# EAGLE schematic MONSTR_V0.1 (EAGLE 6.5.0)
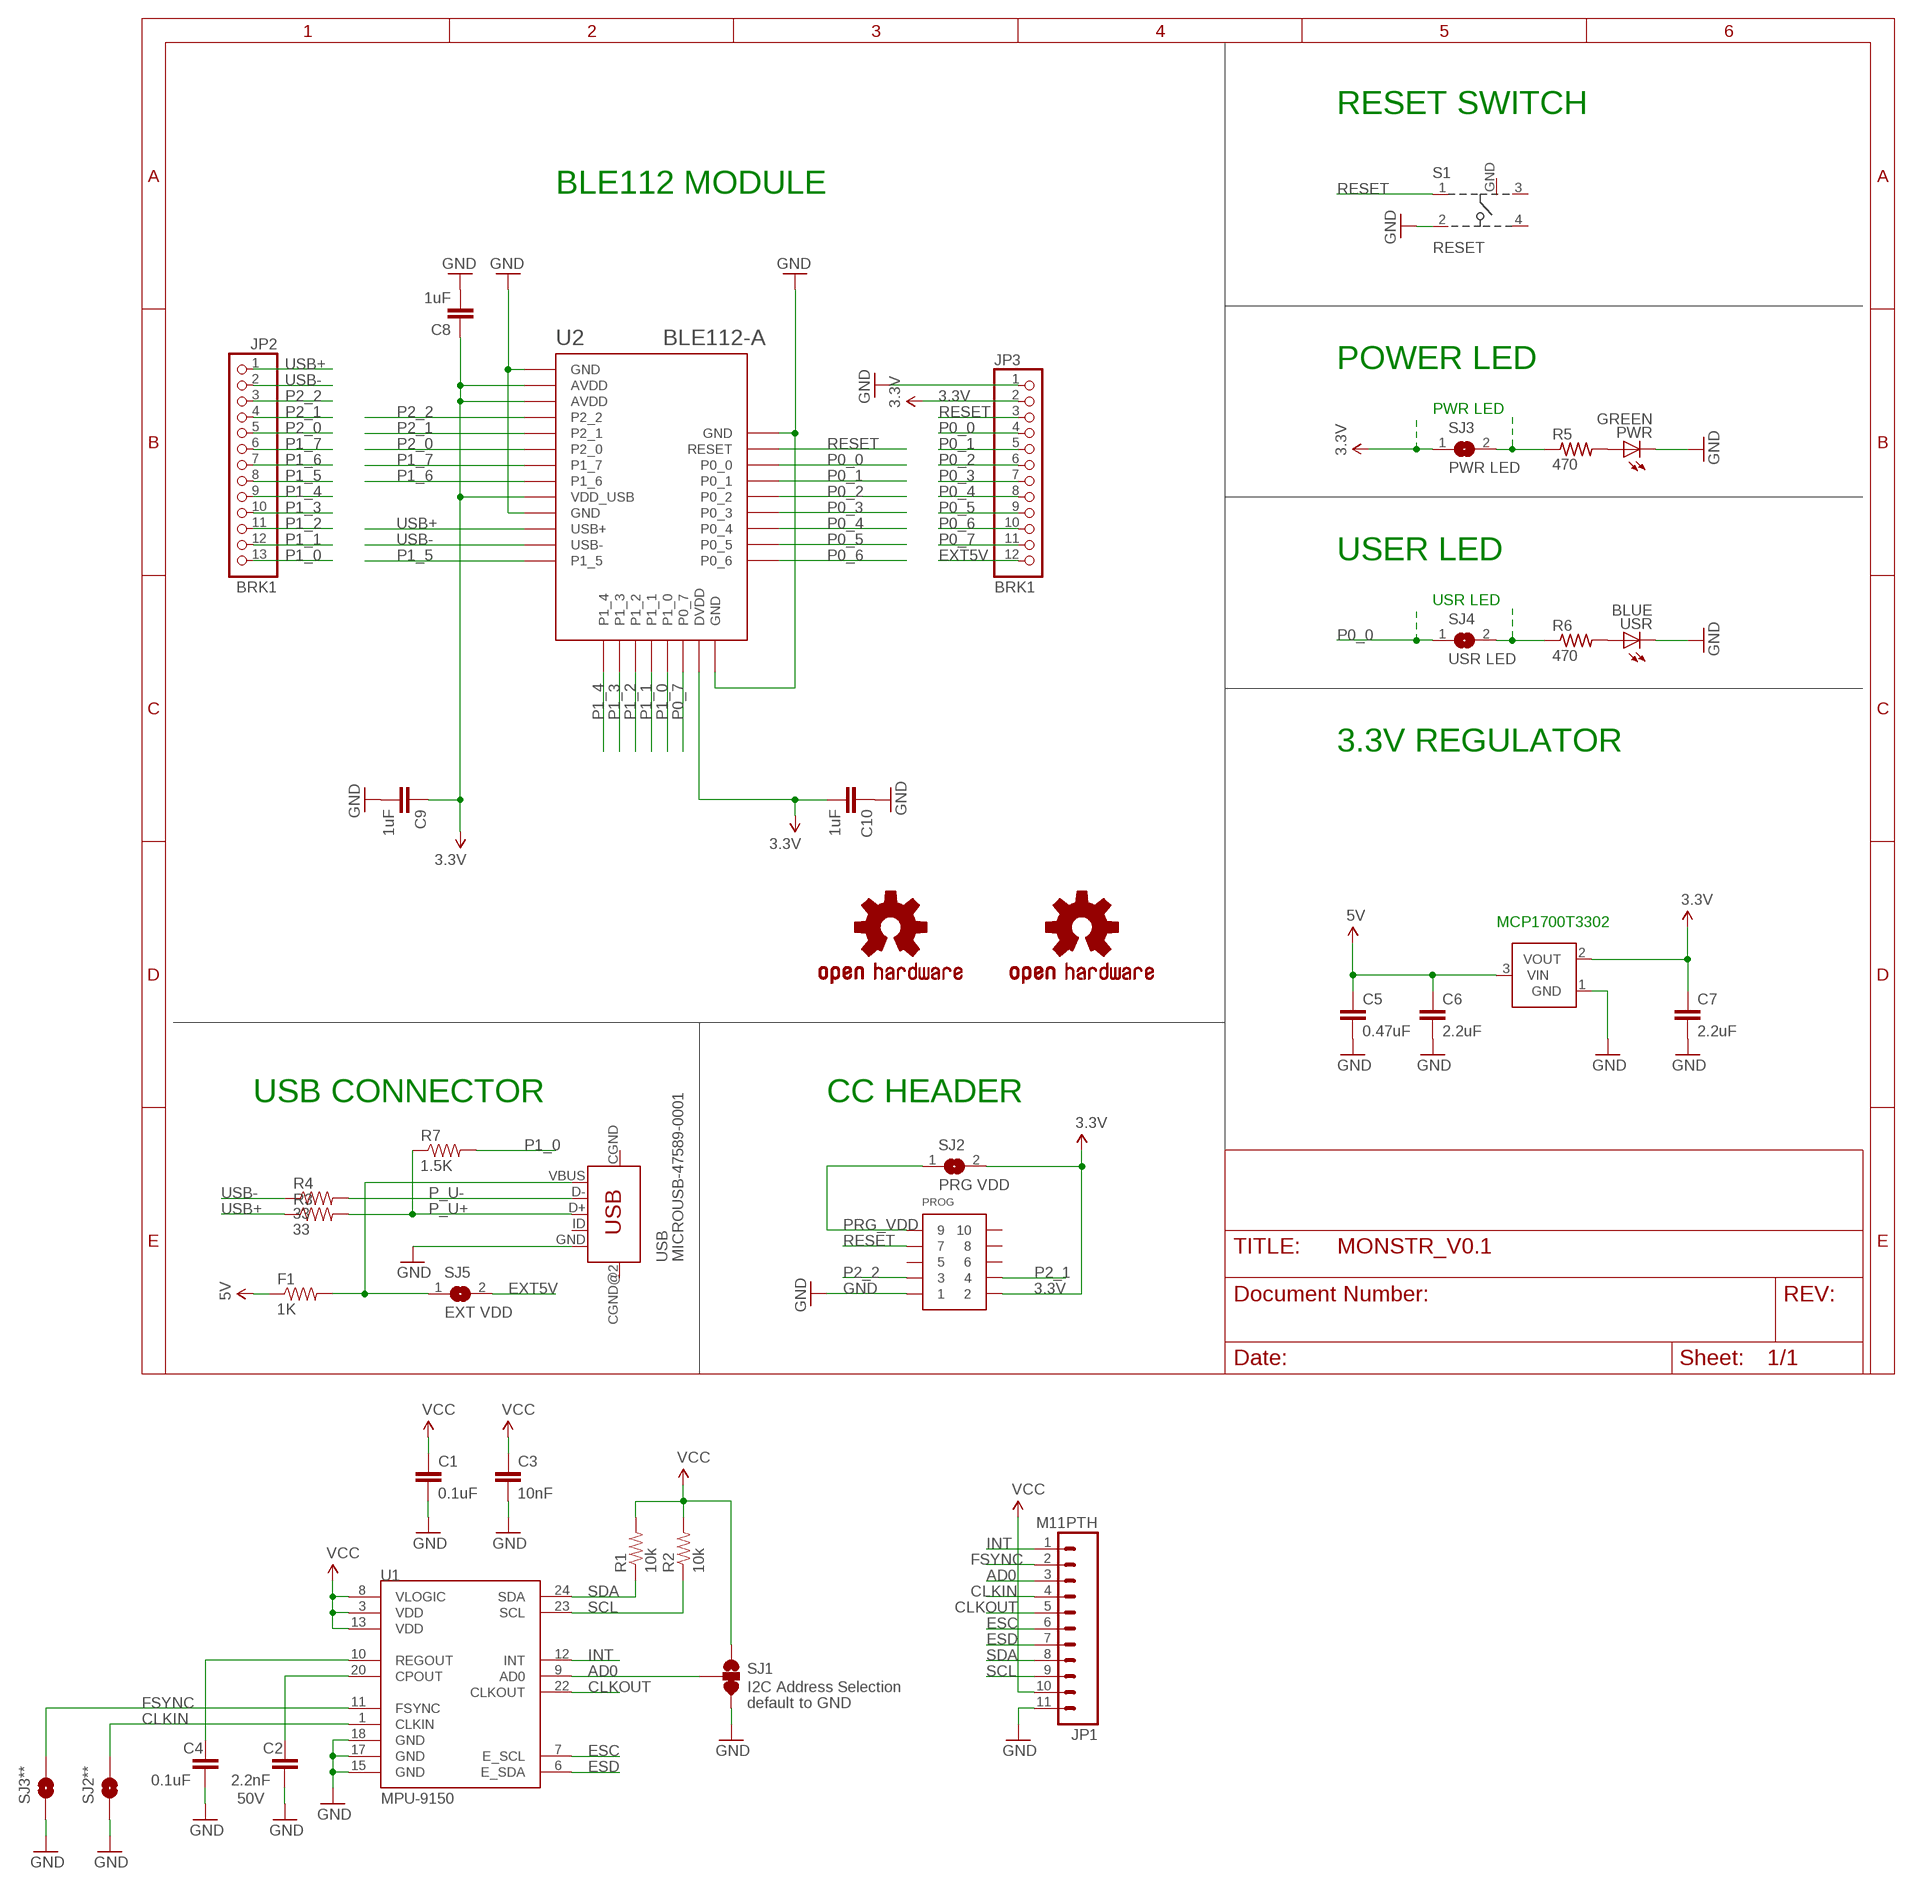
[diagram p0: schematic, sheet 1]

## Parts
C1  0.1uF  CAP0402-CAP  [0402-CAP]
C2  2.2nF  CAP0402-CAP  [0402-CAP]
C3  10nF  CAP0402-CAP  [0402-CAP]
C4  0.1uF  CAP0402-CAP  [0402-CAP]
C5  0.47uF  CAP0603-CAP  [0603-CAP]
C6  2.2uF  CAP0603-CAP  [0603-CAP]
C7  2.2uF  CAP0603-CAP  [0603-CAP]
C8  1uF  CAP0603-CAP  [0603-CAP]
C9  1uF  CAP0603-CAP  [0603-CAP]
C10  1uF  CAP0603-CAP  [0603-CAP]
F1  1K  RESISTOR0805-RES  [0805]
JP1  M11PTH  [1X11]
JP2  BRK1  PINHD-1X13  [1X13]
JP3  BRK1  PINHD-1X12  [1X12]
OSHW1  OSHW-LOGOL  [OSHW-LOGO-L]
OSHW2  OSHW-LOGOS  [OSHW-LOGO-S]
PROG  CONN_5-2-FTSH-V  [FTSH-105-DV]
PWR  GREEN  LEDCHIPLED_0805  [CHIPLED_0805]
R1  10k  RESISTOR0402-RES  [0402-RES]
R2  10k  RESISTOR0402-RES  [0402-RES]
R3  33  RESISTOR0603-RES  [0603-RES]
R4  33  RESISTOR0603-RES  [0603-RES]
R5  470  R-US_R0603  [R0603]
R6  470  R-US_R0603  [R0603]
R7  1.5K  RESISTOR0603-RES  [0603-RES]
S1  RESET  101-IG  [101-IG]
SJ1  SOLDERJUMPER_2WAYPASTE2&3  [SJ_3_PASTE2&3]
SJ2  PRG VDD  SJ  [SJ]
SJ2**  SOLDERJUMPERTRACE  [SJ_2S-TRACE]
SJ3  PWR LED  SJ  [SJ]
SJ3**  SOLDERJUMPERTRACE  [SJ_2S-TRACE]
SJ4  USR LED  SJ  [SJ]
SJ5  EXT VDD  SJ  [SJ]
U1  MPU-9150  MPU-9150QFN-24-NP  [QFN-24-NP]
U2  BLE112-A  BLE112-A-VISUAL  [BLE112-A]
U3  MCP1700  [SOT23-3]
USB  MICROUSB-47589-0001  [MICROUSB-47589-0001]
USR  BLUE  LEDCHIPLED_0805  [CHIPLED_0805]

## Nets
3.3V [power]: C7.1 C8.1 C9.1 C10.2 JP3.2 PROG.2 SJ2.2 SJ3.1 U2.AVDD1(AVDD) U2.AVDD2(AVDD) U2.DVDD U2.VDD_USB U3.2(VOUT)
5V [power]: C5.1 C6.1 F1.1 U3.3(VIN)
AD0: JP1.3 SJ1.2 U1.9(AD0)
CLKIN: JP1.4 SJ2**.2 U1.1(CLKIN)
CLKOUT: JP1.5 U1.22(CLKOUT)
ESC: JP1.6 U1.7(E_SCL)
ESD: JP1.7 U1.6(E_SDA)
EXT5V [power]: JP3.12 SJ5.2
FSYNC: JP1.2 SJ3**.2 U1.11(FSYNC)
GND: C1.2 C2.2 C3.2 C4.2 C5.2 C6.2 C7.2 C8.2 C9.2 C10.1 JP1.11 JP3.1 PROG.1 PWR.C S1.2 SJ1.3 SJ2**.1 SJ3**.1 U1.15(GND) U1.17(GND) U1.18(GND) U2.GND1(GND) U2.GND2(GND) U2.GND3(GND) U2.GND4(GND) U3.1(GND) USB.GND USR.C
INT: JP1.1 U1.12(INT)
N$1: C2.1 U1.20(CPOUT)
N$2: C4.1 U1.10(REGOUT)
N$3: PWR.A R5.2
N$4: R6.2 USR.A
N$5 [power]: R5.1 SJ3.2
N$6: R6.1 SJ4.2
P0_0: JP3.4 SJ4.1 U2.P0_0
P0_1: JP3.5 U2.P0_1
P0_2: JP3.6 U2.P0_2
P0_3: JP3.7 U2.P0_3
P0_4: JP3.8 U2.P0_4
P0_5: JP3.9 U2.P0_5
P0_6: JP3.10 U2.P0_6
P0_7: JP3.11 U2.P0_7
P1_0: JP2.13 R7.2 U2.P1_0
P1_1: JP2.12 U2.P1_1
P1_2: JP2.11 U2.P1_2
P1_3: JP2.10 U2.P1_3
P1_4: JP2.9 U2.P1_4
P1_5: JP2.8 U2.P1_5
P1_6: JP2.7 U2.P1_6
P1_7: JP2.6 U2.P1_7
P2_0: JP2.5 U2.P2_0
P2_1: JP2.4 PROG.4 U2.P2_1
P2_2: JP2.3 PROG.3 U2.P2_2
P_U+: R3.2 R7.1 USB.D+
P_U-: R4.2 USB.D-
PRG_VDD [power]: PROG.9 SJ2.1
RESET: JP3.3 PROG.7 S1.1 U2.RESET
SCL: JP1.8 R2.1 U1.23(SCL)
SDA: JP1.9 R1.1 U1.24(SDA)
USB+: JP2.1 R3.1 U2.USB+
USB-: JP2.2 R4.1 U2.USB-
VBUS [power]: F1.2 SJ5.1 USB.VBUS
VCC: C1.1 C3.1 JP1.10 R1.2 R2.2 SJ1.1 U1.3(VDD) U1.8(VLOGIC) U1.13(VDD)
Unconnected: PROG.5 PROG.6 PROG.8 PROG.10 S1.3 S1.4 USB.CGND(MTN2) USB.CGND@2(MTN4) USB.ID

## Notes on the sheet
- RESET SWITCH
- BLE112 MODULE
- POWER LED
- PWR LED
- USER LED
- USR LED
- 3.3V REGULATOR
- MCP1700T3302
- USB CONNECTOR | CC HEADER
- I2C Address Selection
- default to GND
- 50V

## Power pins joined to a net without a drawn wire
GND: S1.GND

## Library data of the parts
C1-C4 = SparkFun-Passives:CAP: Capacitor Standard 0603 ceramic capacitor, and 0.1" leaded capacitor.
C5-C10 = SparkFun:CAP: Capacitor Standard 0603 ceramic capacitor, and 0.1" leaded capacitor.
F1 R3 R4 R7 = SparkFun:RESISTOR: Resistor Basic schematic elements and footprints for 0603, 1206, and PTH resistors.
JP1 = SparkFun-Connectors:M11: Header 11 Standard 11-pin 0.1" header. Use with straight break away headers (SKU : PRT-00116), right angle break away headers (PRT-00553), swiss pins (PRT-00743), machine pins (PRT-00117), and female headers (PRT-00115).
JP2 = sf-pinhead:PINHD-1X13: PIN HEADER
JP3 = sf-pinhead:PINHD-1X12: PIN HEADER
OSHW1 OSHW2 = SparkFun:OSHW-LOGO: Open Source Hardware Logo This logo indicates the piece of hardware it is found on incorporates a OSHW license and/or adheres to the definition of open source hardware found here: http://freedomdefined.org/OSHW
PROG = pel_misc:CONN_5-2
PWR USR = led:LED: LED OSRAM: - CHIPLED LG R971, LG N971, LY N971, LG Q971, LY Q971, LO R971, LY R971 LH N974, LH R974 LS Q976, LO Q976, LY Q976 LO Q996 - Hyper CHIPLED LW Q18S LB Q993, LB Q99A, LB R99A - SideLED LS A670, LO A670, LY A670, LG A670, LP A670 LB A673, LV A673, LT A673, LW A673 LH A674 LY A675 LS A676, LA A676, LO A676, LY A676, LW A676 LS A679, LY A679, LG A679 - Hyper Micro SIDELED® LS Y876, LA Y876, LO Y876, LY Y876 LT Y87S - SmartLED LW L88C, LW L88S LB L89C, LB L89S, LG L890 LS L89K, LO L89K, LY L89K LS L896, LA L896, LO L896, LY L896 - TOPLED LS T670, LO T670, LY T670, LG T670, LP T670 LSG T670, LSP T670, LSY T670, LOP T670, LYG T670 LG T671, LOG T671, LSG T671 LB T673, LV T673, LT T673, LW T673 LH T674 LS T676, LA T676, LO T676, LY T676, LB T676, LH T676, LSB T676, LW T676 LB T67C, LV T67C, LT T67C, LS T67K, LO T67K, LY T67K, LW E67C LS E67B, LA E67B, LO E67B, LY E67B, LB E67C, LV E67C, LT E67C LW T67C LS T679, LY T679, LG T679 LS T770, LO T770, LY T770, LG T770, LP T770 LB T773, LV T773, LT T773, LW T773 LH T774 LS E675, LA E675, LY E675, LS T675 LS T776, LA T776, LO T776, LY T776, LB T776 LHGB T686 LT T68C, LB T68C - Hyper Mini TOPLED® LB M676 - Mini TOPLED Santana® LG M470 LS M47K, LO M47K, LY M47K Source: http://www.osram.convergy.de LUXEON: - LUMILED® LXK2-PW12-R00, LXK2-PW12-S00, LXK2-PW14-U00, LXK2-PW14-V00 LXK2-PM12-R00, LXK2-PM12-S00, LXK2-PM14-U00 LXK2-PE12-Q00, LXK2-PE12-R00, LXK2-PE12-S00, LXK2-PE14-T00, LXK2-PE14-U00 LXK2-PB12-K00, LXK2-PB12-L00, LXK2-PB12-M00, LXK2-PB14-N00, LXK2-PB14-P00, LXK2-PB14-Q00 LXK2-PR12-L00, LXK2-PR12-M00, LXK2-PR14-Q00, LXK2-PR14-R00 LXK2-PD12-Q00, LXK2-PD12-R00, LXK2-PD12-S00 LXK2-PH12-R00, LXK2-PH12-S00 LXK2-PL12-P00, LXK2-PL12-Q00, LXK2-PL12-R00 Source: www.luxeon.com KINGBRIGHT: KA-3528ASYC Source: www.kingbright.com
R1 R2 = SparkFun-Passives:RESISTOR: Resistor Basic schematic elements and footprints for 0603, 1206, and PTH resistors.
R5 R6 = resistor:R-US_: RESISTOR, American symbol
S1 = sf-keyglove:101-IG
SJ1 = SparkFun-Passives:SOLDERJUMPER_2WAY: Solder Jumper 2 way solder jumper
SJ2-SJ5 = jumper:SJ: SMD solder JUMPER
SJ2** SJ3** = SparkFun-Passives:SOLDERJUMPER: Solder Jumper Standard SMD solder jumper. Used to automate production. Two varients : Normally Open and Normally Closed are the same, but have different paste layers. NC will have a large amount of paste and should jumper during reflow.
U1 = SparkFun-Sensors:MPU-9150: 9DOF (3mag, 3accel, 3rotat). I2C interface.
U2 = sf-bluegiga:BLE112-A-VISUAL: Bluetooth Low Energy single-mode module - Bluetooth 4.0, chip antenna
U3 = nonolith:MCP1700: Voltage regulator
USB = sf-keyglove:MICROUSB-47589-0001

## Net classes
0 default: width 0.152 mm, drill 0.33 mm, clearance 0.152 mm
1 power: width 0.254 mm, drill 0.33 mm, clearance 0.152 mm